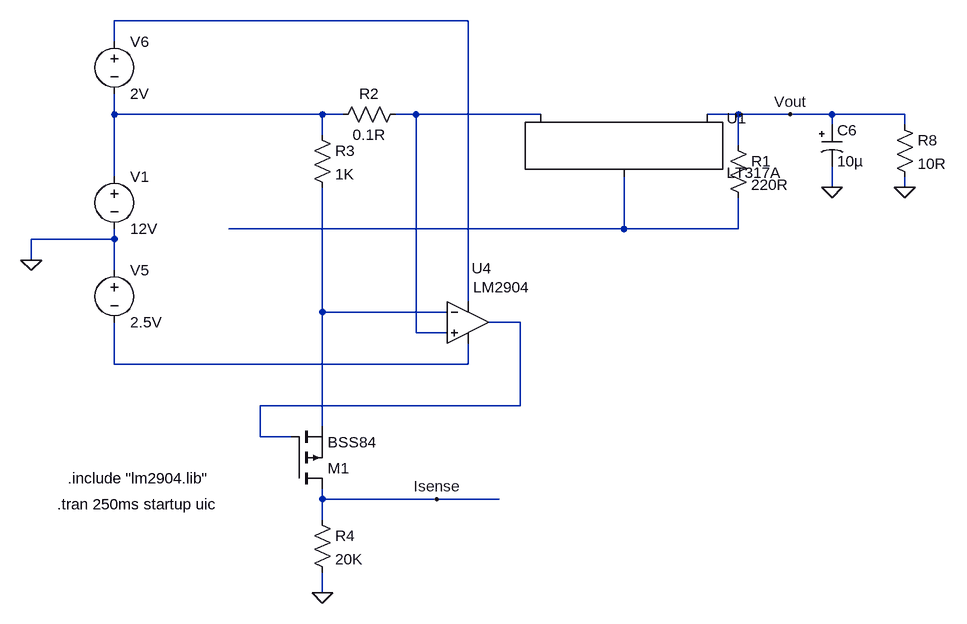
[diagram p0: schematic High side current sense.asc]
High side current sense.asc, the LTspice schematic file:
Version 4
SHEET 1 1336 820
WIRE -64 -512 -608 -512
WIRE -608 -480 -608 -512
WIRE -608 -368 -608 -400
WIRE -288 -368 -608 -368
WIRE -256 -368 -288 -368
WIRE -144 -368 -176 -368
WIRE 48 -368 -144 -368
WIRE 352 -368 304 -368
WIRE 432 -368 352 -368
WIRE 496 -368 432 -368
WIRE 608 -368 496 -368
WIRE 496 -352 496 -368
WIRE 608 -352 608 -368
WIRE -288 -336 -288 -368
WIRE 352 -320 352 -368
WIRE -608 -272 -608 -368
WIRE 496 -256 496 -288
WIRE 608 -256 608 -272
WIRE 176 -192 176 -272
WIRE 176 -192 -432 -192
WIRE 352 -192 352 -240
WIRE 352 -192 176 -192
WIRE -608 -176 -608 -192
WIRE -608 -176 -736 -176
WIRE -736 -144 -736 -176
WIRE -608 -128 -608 -176
WIRE -64 -80 -64 -512
WIRE -288 -64 -288 -256
WIRE -96 -64 -288 -64
WIRE 16 -48 -32 -48
WIRE -144 -32 -144 -368
WIRE -96 -32 -144 -32
WIRE -608 16 -608 -48
WIRE -64 16 -64 -16
WIRE -64 16 -608 16
WIRE 16 80 16 -48
WIRE 16 80 -384 80
WIRE -288 112 -288 -64
WIRE -384 128 -384 80
WIRE -336 128 -384 128
WIRE -288 224 -288 208
WIRE -112 224 -288 224
WIRE -16 224 -112 224
WIRE -288 256 -288 224
WIRE -288 368 -288 336
FLAG -736 -144 0
FLAG 432 -368 Vout
FLAG -288 368 0
FLAG -112 224 Isense
FLAG 496 -256 0
FLAG 608 -256 0
SYMBOL PowerProducts\\LT317A 176 -368 R0
SYMATTR InstName U1
SYMBOL voltage -608 -288 R0
WINDOW 123 0 0 Left 2
WINDOW 39 0 0 Left 2
SYMATTR InstName V1
SYMATTR Value 12V
SYMBOL res 336 -336 R0
SYMATTR InstName R1
SYMATTR Value 220R
SYMBOL res -160 -384 R90
WINDOW 0 0 56 VBottom 2
WINDOW 3 32 56 VTop 2
SYMATTR InstName R2
SYMATTR Value 0.1R
SYMBOL Opamps\\opamp2 -64 -112 R0
WINDOW 3 16 96 Invisible 2
WINDOW 38 8 10 Left 2
WINDOW 0 6 -19 Left 2
SYMATTR Value ""
SYMATTR SpiceModel LM2904
SYMATTR InstName U4
SYMBOL res -304 -352 R0
SYMATTR InstName R3
SYMATTR Value 1K
SYMBOL res -304 240 R0
SYMATTR InstName R4
SYMATTR Value 20K
SYMBOL pmos -336 208 M180
SYMATTR InstName M1
SYMATTR Value BSS84
SYMBOL polcap 480 -352 R0
WINDOW 3 24 56 Left 2
SYMATTR Value 10µ
SYMATTR InstName C6
SYMATTR Description Capacitor
SYMATTR Type cap
SYMATTR SpiceLine V=16 Irms=35m Rser=2.8 Lser=0 mfg="Nichicon" pn="UPR1C100MAH" type="Al electrolytic"
SYMBOL res 592 -368 R0
SYMATTR InstName R8
SYMATTR Value 10R
SYMBOL voltage -608 -144 R0
WINDOW 123 0 0 Left 2
WINDOW 39 0 0 Left 2
SYMATTR InstName V5
SYMATTR Value 2.5V
SYMBOL voltage -608 -496 R0
WINDOW 123 0 0 Left 2
WINDOW 39 0 0 Left 2
SYMATTR InstName V6
SYMATTR Value 2V
TEXT -680 192 Left 2 !.include "lm2904.lib"
TEXT -696 232 Left 2 !.tran 250ms startup uic

The netlist it stands for:
* High side current sense.asc
XU1 N004 Vout N003 LT317A
V1 N002 0 12V
R1 Vout N004 220R
R2 N003 N002 0.1R
XU4 N003 N005 N001 N007 N006 LM2904  ; pins In+ In- V+ V- OUT
R3 N002 N005 1K
R4 Isense 0 20K
M1 Isense N006 N005 N005 BSS84
C6 Vout 0 10µ V=16 Irms=35m Rser=2.8 Lser=0 mfg="Nichicon" pn="UPR1C100MAH" type="Al electrolytic"
R8 Vout 0 10R
V5 0 N007 2.5V
V6 N001 N002 2V
.model NMOS NMOS
.model PMOS PMOS
.lib standard.mos
.include "lm2904.lib"
.tran 250ms startup uic
.lib LTC.lib
.backanno
.end